# Altium schematic sheet Power supplies.SchDoc
size A4; Author: Thomas Kreppel; CompanyName: Universidad de Santiago de Chile; Address1: Avenida Ecuador Nº 3519; Address2: Estación Central, Santiago; Address3: Chile; DocumentNumber: 6; SheetNumber: 6; SheetTotal: 6
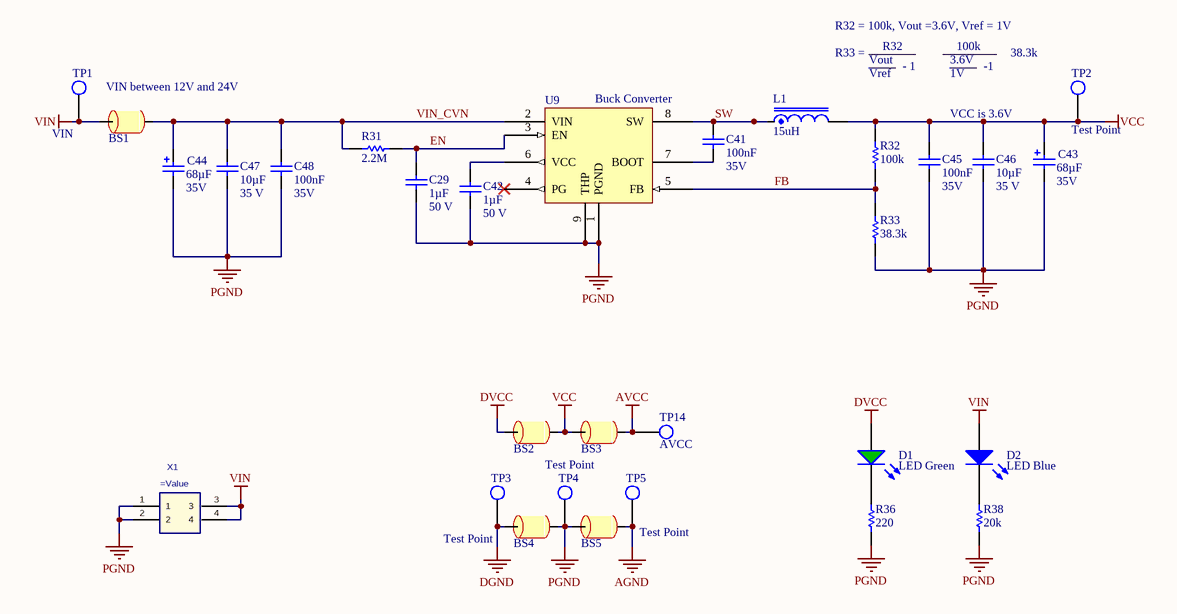
[diagram p0: Power supplies.SchDoc]

## Parts
BS1  Ferrite bead  [RES_1206]  (value not drawn)
BS2  Ferrite bead  [RES_1206]  (value not drawn)
BS3  Ferrite bead  [RES_1206]  (value not drawn)
BS4  Ferrite bead  [RES_1206]  (value not drawn)
BS5  Ferrite bead  [RES_1206]  (value not drawn)
C29  1µF  Voltage: 50 V  [CAP_0603]
C41  100nF  Voltage: 35V  [CAP_0603]
C42  1µF  Voltage: 50 V  [CAP_0603]
C43  68µF  Voltage: 35V  [WCAP-ATG8_6.3x11]
C44  68µF  Voltage: 35V  [WCAP-ATG8_6.3x11]
C45  100nF  Voltage: 35V  [CAP_0603]
C46  10µF  Voltage: 35 V  [RES_1206]
C47  10µF  Voltage: 35 V  [RES_1206]
C48  100nF  Voltage: 35V  [CAP_0603]
D1  LED Green  [WL-SMCW_0603]
D2  LED Blue  [WL-SMCW_0603]
L1  15uH  [SMT_inductor_1050_Performance]
R31  2.2M  [RES_0603]
R32  100k  [RES_0603]
R33  38.3k  [RES_0603]
R36  220  [RES_0603]
R38  20k  [RES_0603]
TP1  VIN  [TP_1.6mm]  (no BOM)
TP2  Test Point  [TP_1.6mm]  (no BOM)
TP3  Test Point  [TP_1.6mm]  (no BOM)
TP4  Test Point  [TP_1.6mm]  (no BOM)
TP5  Test Point  [TP_1.6mm]  (no BOM)
TP14  AVCC  [TP_1.6mm]  (no BOM)
U9  Buck Converter  [SOIC127P600X170_HS-9N]
X1  (no value)  [IPL1-102-01-L-D-K]

## Nets
AGND: BS5.2 TP5.1
AVCC: BS3.2 TP14.1
DGND: BS4.1 TP3.1
DVCC: BS2.1 D1.2(A)
PGND: BS4.2 BS5.1 C29.2 C42.2 C43.1(N) C44.1(N) C45.2 C46.2 C47.2 C48.2 R33.1 R36.1 R38.2 TP4.1 U9.1(PGND) U9.9(THP) X1.1 X1.2
VCC: BS2.2 BS3.1 C43.2(P) C45.1 C46.1 L1.2 R32.2 TP2.1
VIN: BS1.1 D2.2(A) TP1.1 X1.3 X1.4
EN: C29.1 R31.1 U9.3(EN)
FB: R32.1 R33.2 U9.5(FB)
SW: C41.1 L1.1 U9.8(SW)
VIN_CVN: BS1.2 C44.2(P) C47.1 C48.1 R31.2 U9.2(VIN)
NetC41_2: C41.2 U9.7(BOOT)
NetC42_1: C42.1 U9.6(VCC)
NetD1_1: D1.1(K) R36.2
NetD2_1: D2.1(K) R38.1

Not connected (* = marked no-connect by the designer): U9 4(PG)*

## Notes on the sheet
- R32 = 100k, Vout =3.6V, Vref = 1V
- R33 =
- Vout
- R32
- 3.6V
- 100k
- (near TP2) 38.3k
- VIN between 12V and 24V
- Vref
- - 1
- VCC is 3.6V
- 1V
- -1
- Title
- Size:
- Date:
- A4
- Revision:
- Time:
- Sheet
- of
- Author:
- Project:

## Library data of the parts
BS1-BS5 = Bead: 6A; MPN: 742792121; MF: Würth Elektronik; DCR: 60mOhm; I_r: 3A; Supplier 1: Digikey; Supplier Part Number 1: 732-4654-1-ND; Package: 1206; LCSC Part Number: C5271178
C29 = Cap_0603: Capacitor Ceramic; MPN: C0603C105K3RACTU; MF: KEMET; Tolerance: 10%; Dielectricum: X7R; Value: 1µF; Supplier 1: Digikey; Supplier Part Number 1: 399-7376-1-ND; Package: 0603; LCSC Part Number: C2177372
C41 C45 C48 = Cap_0603: Capacitor; MPN: C0603C104M5RACTU; Rule: PcbType=ProtelPcb; MF: KEMET; Dielectricum: X7R; Tolerance: 10%; Published: 8-Jun-2000; LatestRevisionDate: 17-Jul-2002; LatestRevisionNote: Re-released for DXP Platform.; PackageReference: RAD-0.3; Publisher: Altium Limited; Value: 100nF; Supplier 1: Digikey; Supplier Part Number 1: 399-7845-1-ND; Package: 0603; LCSC Part Number: C14663
  C41: Supplier 2: Mouser
C42 = Cap_0603: Capacitor Ceramic; MPN: C0603C105K3RACTU; MF: KEMET; Dielectricum: X7R; Tolerance: 10%; Value: 1µF; Supplier 1: Digikey; Supplier Part Number 1: 399-7376-1-ND; Package: 0603; LCSC Part Number: C2177372
C43 C44 = 860010573006: WCAP-ATG8 THT Aluminum Electrolytic Capacitors, D6.3mm x L11mm, 68uF, +/-20%, 35VDC; Dissipation Factor: 12%; Endurance: 2000h; Leakage Current: 23.8uA; Ripple Current max.: 198mA; Technical Reference: ATBD110680M035DSPA4B000; ComponentLink1Description: Manufacturer; ComponentLink1URL: http://www.we-online.de; ComponentLink2Description: Datasheet; ComponentLink2URL: https://katalog.we-online.com/pbs/datasheet/860010573006.pdf; Length: 11mm; Mounting Technology: THT; Operating Temperature: -40 to +85degC; Packaging: Ammo Pack; Published Date: August 2019; Value: 68µF; Diameter: 6.3mm; Part Number: 860010573006; Publisher: Wurth Elektronik; Tolerance: +/-20%; Supplier 1: Digikey; Supplier Part Number 1: 732-8736-1-ND; LCSC Part Number: C1668506
C46 C47 = Cap_1206: Capacitor; MPN: GRM319R6YA106KA12D; Dielectricum: X7R; Tolerance: 10%; Value: 10µF; Supplier 1: Digikey; Supplier Part Number 1: 490-9964-1-ND; MF: *; Package: 1206; LCSC Part Number: C123678
D1 = UZgen_LED_0603_Green: Standard LEDs - SMD 0603 green; Manufacturer: UZgen; Created from: UZgenTool; ComponentLink1Description: N/A; ComponentLink1URL: N/A; Supplier 1: LCSC; Supplier Part Number 1: C2986059; Manufacturer Part Number: UZgen_LED_0603_Green; PartID: 21; Created On: 09/09/2024 10:45:01; Component Type: LED Diode; Device Package: 0603; Last Updated: 09/09/2024 10:45:01; Mounting Type: SMD; Type: Standard; Value: LED Green; Live Cycle Status: 1; Stock number: not stored; Color: green; LCSC Part Number: C2986059
D2 = UZgen_LED_0603_Blue: Standard LEDs - SMD 0603 blue; Manufacturer: UZgen; Created from: UZgenTool; ComponentLink1Description: N/A; ComponentLink1URL: N/A; Supplier 1: LCSC; Supplier Part Number 1: C965807; Manufacturer Part Number: UZgen_LED_0603_Blue; PartID: 20; Created On: 09/09/2024 10:45:01; Component Type: LED Diode; Device Package: 0603; Last Updated: 09/09/2024 10:45:01; Mounting Type: SMD; Type: Standard; Value: LED Blue; Live Cycle Status: 1; Stock number: not stored; Color: blue; LCSC Part Number: C965807
L1 = B82464G4154M: SMT power Inductor, 15uH, 40m DRC; Rated Current: 3.7 A; MF: Murata; Supplier 1: Digikey; Supplier Part Number 1: 811-3837-1-ND; Value: 15uH; DCR: 40m; Supplier 2: Mouser; LCSC Part Number: C6818993
R31 = Res0603: MPN: RC0603FR-072M2L; MF: Yageo; Tolerance: 1%; Published: 8-Jun-2000; LatestRevisionDate: 17-Jul-2002; LatestRevisionNote: Re-released for DXP Platform.; PackageReference: AXIAL-0.3; Publisher: Altium Limited; PackageDescription: Axial Device, Thru-Hole; 2 Leads; 0.3 in Pin Spacing; Value: 2.2M; Supplier 1: Digikey; Supplier Part Number 1: YAG3329CT-ND; Package: 0603
R32 = Res0603: MPN: RC0603FR-07100KL; MF: Yageo; Tolerance: 1%; Published: 8-Jun-2000; LatestRevisionDate: 17-Jul-2002; LatestRevisionNote: Re-released for DXP Platform.; PackageReference: AXIAL-0.3; Publisher: Altium Limited; PackageDescription: Axial Device, Thru-Hole; 2 Leads; 0.3 in Pin Spacing; Value: 100k; Supplier 1: Digikey; Supplier Part Number 1: 311-100KHRCT-ND; Package: 0603
R33 = Res0603: Tolerance: 1%; Published: 8-Jun-2000; LatestRevisionDate: 17-Jul-2002; LatestRevisionNote: Re-released for DXP Platform.; PackageReference: AXIAL-0.3; Publisher: Altium Limited; PackageDescription: Axial Device, Thru-Hole; 2 Leads; 0.3 in Pin Spacing; Value: 38.3k; Supplier 1: Digikey; Supplier 2: Mouser; Supplier Part Number 1: 311-38.3KHRCT-ND; Package: 0603
R36 = Res0603: MPN: RC0603JR-07220RL; Tolerance: 1%; Published: 8-Jun-2000; LatestRevisionDate: 17-Jul-2002; LatestRevisionNote: Re-released for DXP Platform.; PackageReference: AXIAL-0.3; Publisher: Altium Limited; PackageDescription: Axial Device, Thru-Hole; 2 Leads; 0.3 in Pin Spacing; Value: 220; Supplier 1: Digikey; Supplier 2: Mouser; Supplier Part Number 1: 311-220GRCT-ND; Package: 0603
R38 = Res0603: MPN: RC0603FR-07330RL; MF: Yageo; Tolerance: 1%; Published: 8-Jun-2000; LatestRevisionDate: 17-Jul-2002; LatestRevisionNote: Re-released for DXP Platform.; PackageReference: AXIAL-0.3; Publisher: Altium Limited; PackageDescription: Axial Device, Thru-Hole; 2 Leads; 0.3 in Pin Spacing; Supplier Part Number 1: 311-330HRCT-ND; Value: 20k; Supplier 1: Digikey; Package: 0603
TP1-TP5 TP14 = TP: 1.6mm Test Point Keystone; MPN: 5006; MF: Keystone Electronics; Created: 2020_04_Kreppel; Supplier 1: Digikey; Supplier Part Number 1: 36-5006-ND
U9 = LMR33620A: 3.8V to 36V, 2A synchronous step-down converter; MPN: LMR33620ADDA; Switching frequency: 400kHz; MF: Texas Instruments; Created: 4/20 Kreppel; Supplier 1: Digikey; Supplier Part Number 1: 296-48841-ND; Supplier 2: Mouser; LCSC Part Number: C2071694
X1 = IPL1-102-XX-X-D-X: 2.54mm Double Row Terminal Assembly, Right-Angled; MF: SAMTEC; Value: IPL1-102-01-L-D-K; Created: 2018_05_02_AGeiger; MPN: IPL1-102-01-L-D-K; MF: Samtec; Supplier 1: Digikey; Supplier Part Number 1: SAM10565-ND